# EAGLE design switching_vca (EAGLE 6.4)
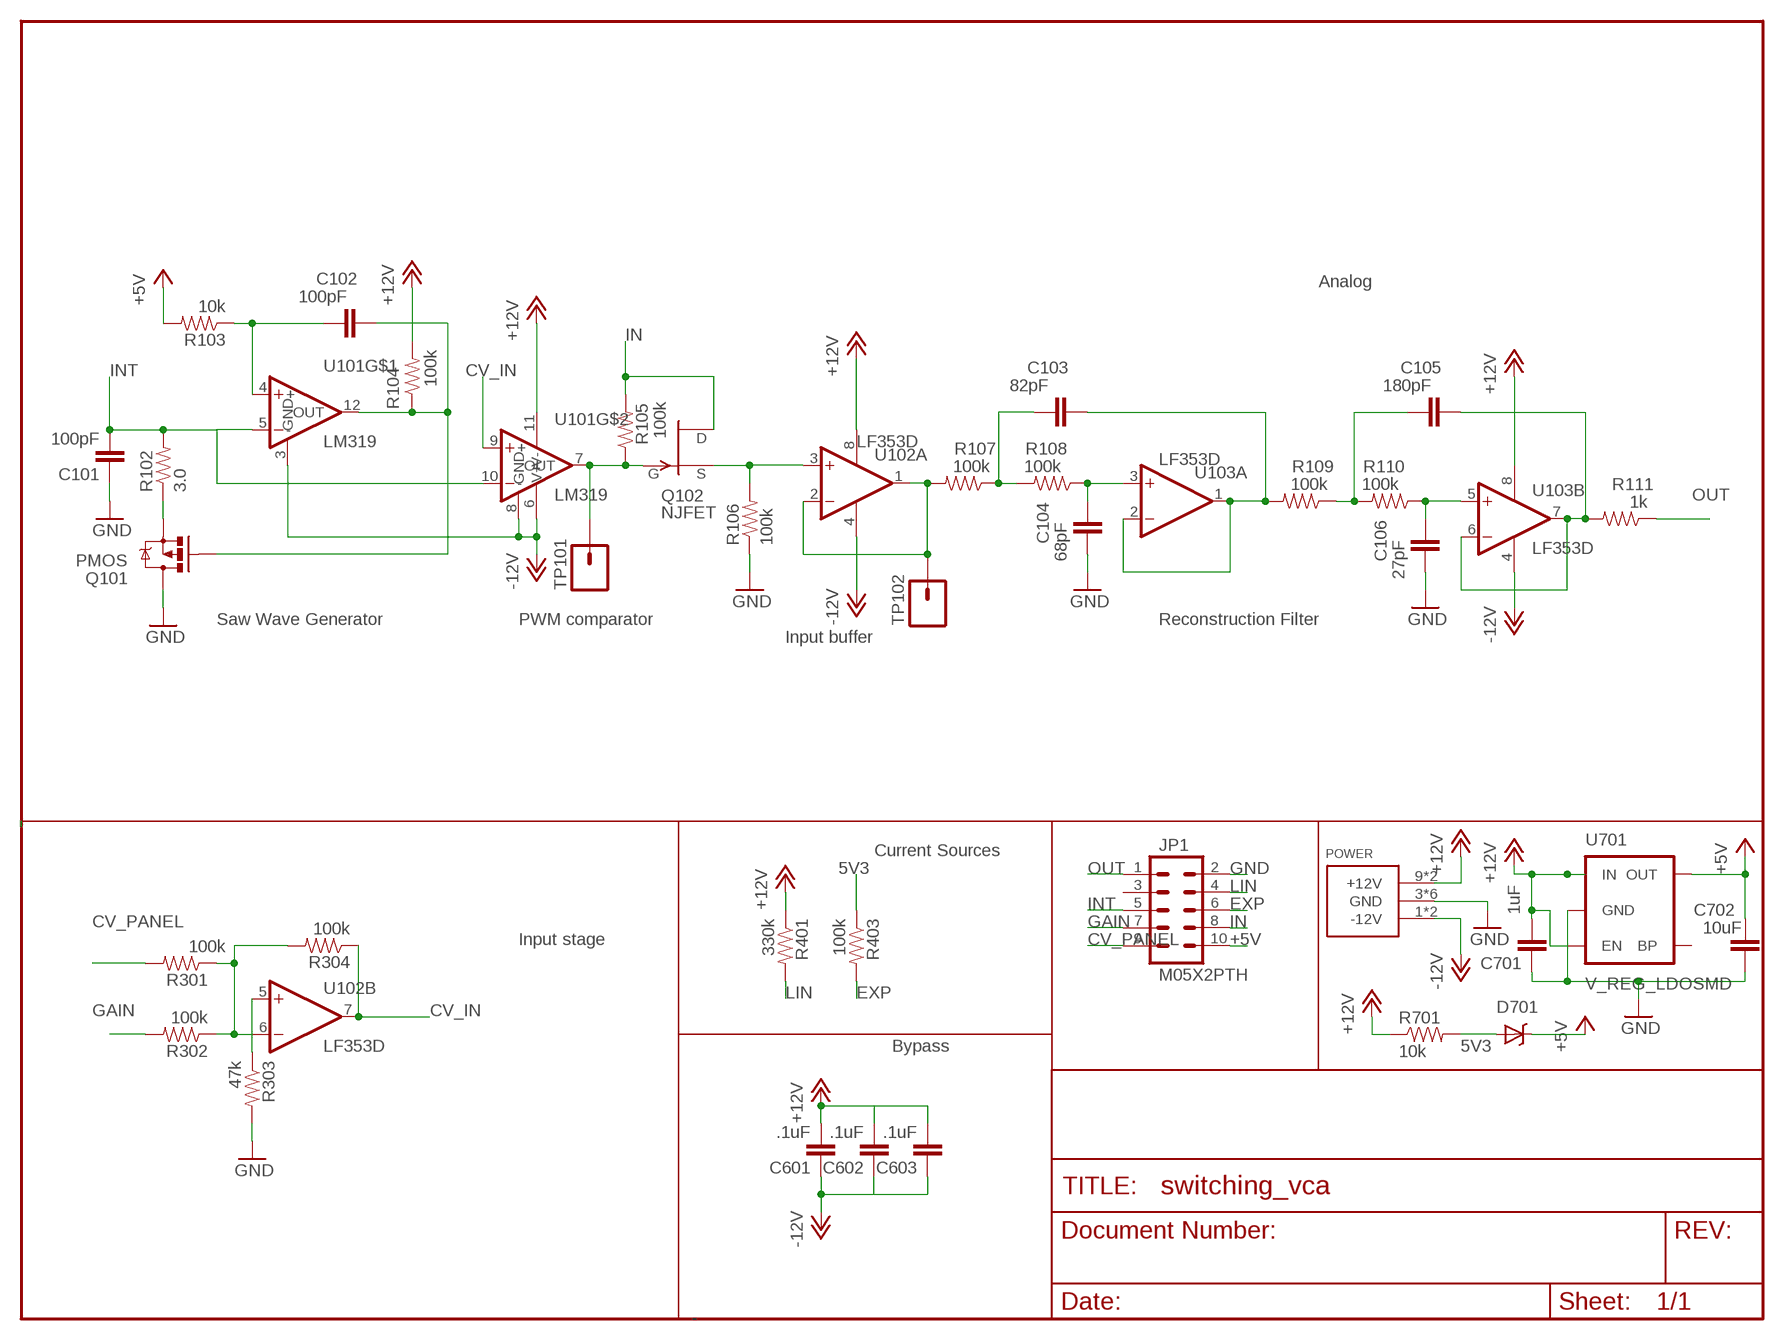
[diagram p0: schematic, sheet 1]

## Parts
C101  100pF  CAP0603-CAP  [0603-CAP]
C102  100pF  CAP0603-CAP  [0603-CAP]
C103  82pF  CAP0603-CAP  [0603-CAP]
C104  68pF  CAP0603-CAP  [0603-CAP]
C105  180pF  CAP0603-CAP  [0603-CAP]
C106  27pF  CAP0603-CAP  [0603-CAP]
C601  .1uF  CAP0603-CAP  [0603-CAP]
C602  .1uF  CAP0603-CAP  [0603-CAP]
C603  .1uF  CAP0603-CAP  [0603-CAP]
C701  1uF  CAP0805  [0805]
C702  10uF  CAP1206  [1206]
D701  DIODE-SCHOTTKY  [SOD-323]
JP1  M05X2PTH  [AVR_ICSP]
POWER  POWER_SIMPLE16  [POWER_16]
Q101  PMOS  MOSFET-PCHANNELSMD  [SOT23-3]
Q102  NJFET  SST5484  [SOT23]
R102  3.0  RESISTOR0603-RES  [0603-RES]
R103  10k  RESISTOR0603-RES  [0603-RES]
R104  100k  RESISTOR0603-RES  [0603-RES]
R105  100k  RESISTOR0603-RES  [0603-RES]
R106  100k  RESISTOR0603-RES  [0603-RES]
R107  100k  RESISTOR0603-RES  [0603-RES]
R108  100k  RESISTOR0603-RES  [0603-RES]
R109  100k  RESISTOR0603-RES  [0603-RES]
R110  100k  RESISTOR0603-RES  [0603-RES]
R111  1k  RESISTOR0603-RES  [0603-RES]
R301  100k  RESISTOR0603-RES  [0603-RES]
R302  100k  RESISTOR0603-RES  [0603-RES]
R303  47k  RESISTOR0603-RES  [0603-RES]
R304  100k  RESISTOR0603-RES  [0603-RES]
R401  330k  RESISTOR0603-RES  [0603-RES]
R403  100k  RESISTOR0603-RES  [0603-RES]
R701  10k  RESISTOR0603-RES  [0603-RES]
TP101  M01PTH  [1X01]
TP102  M01PTH  [1X01]
U101  LM319  [SOP-14]
U102  LF353D  [SO08]
U103  LF353D  [SO08]
U701  V_REG_LDOSMD  [SOT23-5]

## Nets
5V3: D701.1(A) R403.1 R701.2
+5V: C702.1 D701.2(C) JP1.10 R103.2 U701.5(OUT)
+12V: C601.2 C602.2 C603.2 C701.2 POWER.9(+12V) POWER.10(+12V) R104.2 R401.1 R701.1 U101.11(V+) U102.8(P:V+) U103.8(P:V+) U701.1(IN) U701.3(EN)
-12V: C601.1 C602.1 C603.1 POWER.1(-12V) POWER.2(-12V) U101.3(GND) U101.6(V-) U101.8(GND) U102.4(P:V-) U103.4(P:V-)
CV_IN: R304.1 U102.7(B:OUT)
CV_PANEL: JP1.9 R301.2
EXP: JP1.6 R403.2
GAIN: JP1.7 R302.2
GND: C101.1 C104.2 C106.2 C701.1 C702.2 JP1.2 POWER.3(GND) POWER.4(GND) POWER.5(GND) POWER.6(GND) POWER.7(GND) POWER.8(GND) Q101.3(D) R106.1 R303.2 U701.2(GND)
IN: JP1.8 Q102.1(D) R105.2
INT: C101.2 JP1.5 R102.2 U101.5(-) U101.10(-)
LIN: JP1.4 R401.2
N$: C102.1 Q101.1(G) R104.1 U101.12(OUT)
N$1: Q101.2(S) R102.1
N$3: Q102.3(G) R105.1 TP101.1 U101.7(OUT)
N$4: C102.2 R103.1 U101.4(+)
N$5: C103.1 R109.2 U103.1(A:OUT) U103.2(A:-IN)
N$6: Q102.2(S) R106.2 U102.3(A:+IN)
N$7: C103.2 R107.1 R108.2
N$8: C104.1 R108.1 U103.3(A:+IN)
N$10: R303.1 U102.5(B:+IN)
N$11: C105.2 R109.1 R110.2
N$12: C106.1 R110.1 U103.5(B:+IN)
N$13: C105.1 R111.2 U103.6(B:-IN) U103.7(B:OUT)
N$15: R107.2 TP102.1 U102.1(A:OUT) U102.2(A:-IN)
OUT: JP1.1 R111.1
R301: R301.1 R302.1 R304.2 U102.6(B:-IN)
Unconnected: JP1.3 U101.9(+) U701.4(BP)

## Notes on the sheet
- Analog
- Saw Wave Generator | PWM comparator | Reconstruction Filter
- Input buffer
- Current Sources
- Input stage
- Bypass

## Library data of the parts
C101-C106 C601-C603 C701 C702 = SparkFun:CAP: Capacitor Standard 0603 ceramic capacitor, and 0.1" leaded capacitor.
D701 = SparkFun:DIODE-SCHOTTKY
JP1 = SparkFun:M05X2: Header 5x2 Standard 10-pin dual row 0.1" header. Commonly used with AVR-ISP. Use with Spark Fun Electronics SKU: PRT-00778
POWER = eurorack:POWER_SIMPLE
Q101 = SparkFun:MOSFET-PCHANNEL
Q102 = transistor-fet:?548*: N-Channel JFETs Source: VISHAY 2N5484.pdf Compatible: TO92 2N5245 J304 J305 U310 J308 J309 J310 TO72 2N4416 2N4416A 2N3823 2N4351 3N169 3N170 3N171 MFE3002 TO18 2N3796 2N3797 MFE825 Source: Motorola European Master Guide Pacge 3-59
R102-R111 R301-R304 R401 R403 R701 = SparkFun:RESISTOR: Resistor Basic schematic elements and footprints for 0603, 1206, and PTH resistors.
TP101 TP102 = SparkFun:M01: Header 1 Standard 1-pin 0.1" header. Use with straight break away headers (SKU : PRT-00116), right angle break away headers (PRT-00553), swiss pins (PRT-00743), machine pins (PRT-00117), and female headers (PRT-00115).
U101 = russruss:LM319
U102 U103 = linear:LF353: OP AMP
U701 = SparkFun:V_REG_LDO: Voltage Regulator LDO Standard 150mA LDO voltage regulator in SOT-23 layout. Micrel part MIC5205. BP (by-pass) pin is used to lower output noise with 470pF cap.

## Board
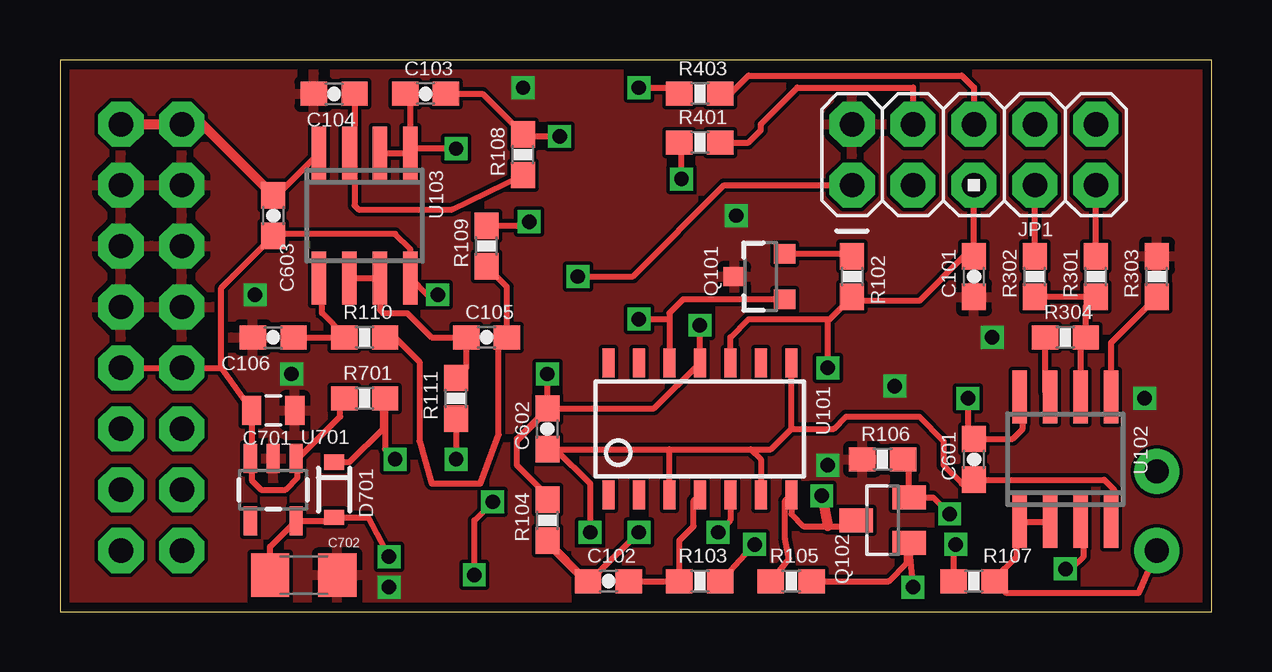
[diagram p1: board, top side]
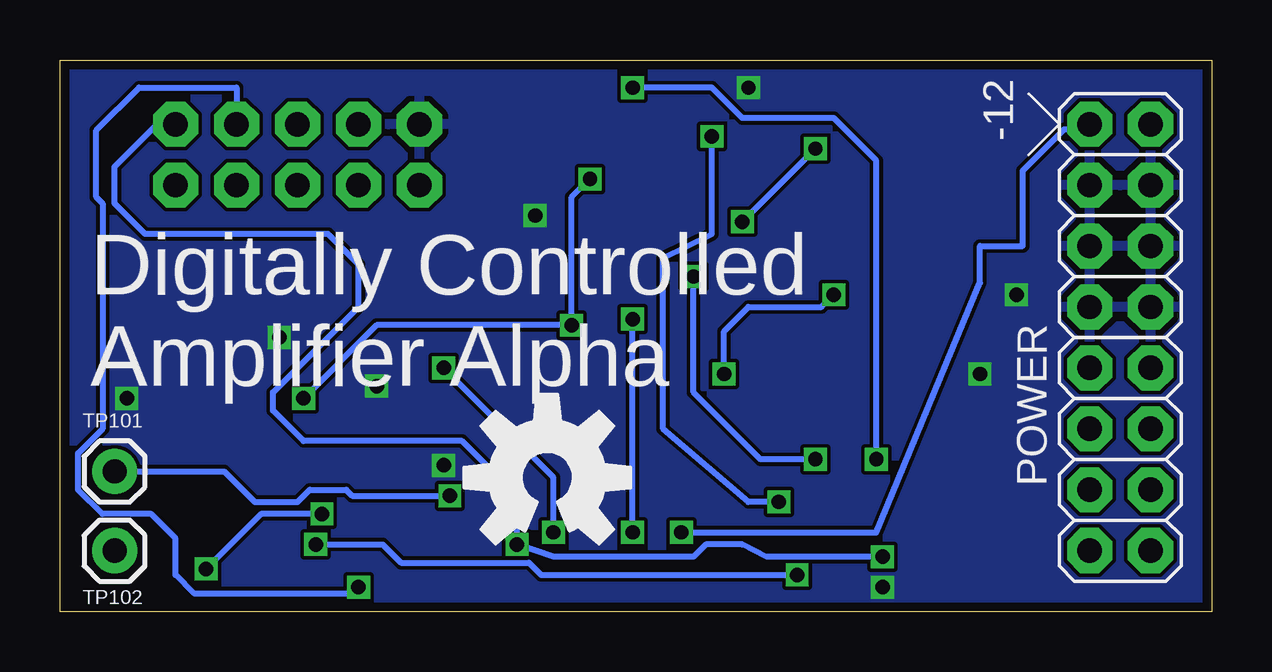
[diagram p2: board, bottom side, seen from below]

Size 48 x 23 mm. Coordinates in mm from the lower left corner, seen from the top.
Outline: 0,0 48,0 48,23 0,23 0,0
Copper layers (1*16): Top 0.0356mm / dielectric 1.5011mm / Bottom 0.0356mm
Design rules "LaenPCBOrder": minimum track width 6mil, minimum drill 13mil, track to track 6mil, track to pad 6mil, pad to pad 6mil, via to via 6mil, smd to smd 6mil, copper to edge 15mil, drill to drill 6mil, minimum pad ring 7mil, minimum via ring 7mil, stop-mask expansion 4mil, vias tented up to drill 0mil, thermal gap 10mil

### Footprints (pad centres in the part's own frame; a part is rotated, then mirrored left to right if it is on the bottom)
0603-CAP = smd 1.1 x 1: 1 -0.85,0; 2 0.85,0
0805 = smd 0.8 x 1.2: 1 -0.9,0; 2 0.9,0
1206 = smd 1.6 x 1.8: 1 -1.4,0; 2 1.4,0
SOD-323 = smd 0.63 x 0.83: 1 -1.15,0; 2 1.15,0
AVR_ICSP = drill 1.016 pad 1.88 octagon: 1 -1.27,5.08; 2 1.27,5.08; 3 -1.27,2.54; 4 1.27,2.54; 5 -1.27,0; 6 1.27,0; 7 -1.27,-2.54; 8 1.27,-2.54; 9 -1.27,-5.08; 10 1.27,-5.08
POWER_16 = drill 1.016 pad 1.88 octagon: 1 -6.35,-1.27; 2 -6.35,1.27; 3 -3.81,-1.27; 4 -3.81,1.27; 5 -1.27,-1.27; 6 -1.27,1.27; 7 1.27,-1.27; 8 1.27,1.27; 9 3.81,-1.27; 10 3.81,1.27; 11 6.35,-1.27; 12 6.35,1.27; 13 8.89,-1.27; 14 8.89,1.27; 15 11.43,-1.27; 16 11.43,1.27
SOT23-3 = smd 0.8 x 0.9: 1 -0.95,-1; 2 0.95,-1; 3 0,1.1
SOT23 = smd 1 x 1.4: 1 -0.95,-1.1; 2 0.95,-1.1; 3 0,1.1
0603-RES = smd 1.1 x 1: 1 -0.85,0; 2 0.85,0
1X01 = drill 1.016 pad 1.88: 1 0,0
SOP-14 = smd 0.5 x 1.2: 1 -3.81,-2.75; 2 -2.54,-2.75; 3 -1.27,-2.75; 4 0,-2.75; 5 1.27,-2.75; 6 2.54,-2.75; 7 3.81,-2.75; 8 3.81,2.75; 9 2.54,2.75; 10 1.27,2.75; 11 0,2.75; 12 -1.27,2.75; 13 -2.54,2.75; 14 -3.81,2.75
SO08 = smd 0.6 x 2.2: 1 -1.905,-2.6; 2 -0.635,-2.6; 3 0.635,-2.6; 4 1.905,-2.6; 5 1.905,2.6; 6 0.635,2.6; 7 -0.635,2.6; 8 -1.905,2.6
SOT23-5 = smd 0.55 x 1.2: 1 -0.95,-1.3; 2 0,-1.3; 3 0.95,-1.3; 4 0.95,1.3; 5 -0.95,1.3

### Placement (x,y rotation side)
C101  38.1,13.97 90 top
C102  22.86,1.27 0 top
C103  15.24,21.59 0 top
C104  11.43,21.59 180 top
C105  17.78,11.43 0 top
C106  8.89,11.43 180 top
C601  38.1,6.35 90 top
C602  20.32,7.62 90 top
C603  8.89,16.51 270 top
C701  8.89,8.38 180 top
C702  10.16,1.52 0 top
D701  11.43,5.08 270 top
JP1  38.1,19.05 90 top
POWER  3.81,13.97 270 bottom
Q101  29.21,13.97 90 top
Q102  34.29,3.81 90 top
R102  33.02,13.97 270 top
R103  26.67,1.27 0 top
R104  20.32,3.81 90 top
R105  30.48,1.27 0 top
R106  34.29,6.35 0 top
R107  38.1,1.27 0 top
R108  19.3,19.05 90 top
R109  17.78,15.24 90 top
R110  12.7,11.43 0 top
R111  16.51,8.89 90 top
R301  43.18,13.97 90 top
R302  40.64,13.97 90 top
R303  45.72,13.97 90 top
R304  41.91,11.43 0 top
R401  26.67,19.56 0 top
R403  26.67,21.59 0 top
R701  12.7,8.89 0 top
TP101  45.72,5.84 0 bottom
TP102  45.72,2.54 0 bottom
U101  26.67,7.62 0 top
U102  41.91,6.35 0 top
U103  12.7,16.51 180 top
U701  8.89,5.08 180 top
U$1  [OSHW-LOGO-L]  27.69,5.59 0 bottom

### Tracks (layer width: path | path; a pad name or v marks a point on that pad's centre or on a via)
5V3  (via drill 0.6)
  Top 0.254: D701.1 12.07,6.23 13.46,7.62 13.46,8.8 R701.2 13.55,6.77 v13.97,6.35 | v24.13,21.84 25.57,21.84 R403.1
  Bottom 0.254: v13.97,6.35 13.97,18.8 15.75,20.57 19.56,20.57 20.83,21.84 v24.13,21.84
+5V  (via drill 0.6)
  Top 0.254: C702.1 8.76,2.7 U701.5 11.28,3.78 D701.2 12.83,3.93 v13.72,2.29 | v28.96,2.79 27.94,1.69 R103.2
  Bottom 0.254: v13.72,2.29 18.54,2.29 19.56,2.79 21.08,2.79 21.59,2.29 27.43,2.29 v28.96,2.79 28.96,4.83 31.24,7.11 37.85,7.11 39.12,8.38 39.12,9.14 35.56,12.7 35.56,14.48 36.83,15.75 44.45,15.75 45.72,17.02 45.72,18.54 43.94,20.32 JP1.10
+12V  (via drill 0.6)
  Top 0.254: POWER.10 POWER.9 6.72,10.16 | 6.72,10.16 C701.2 7.99,6.43 7.99,5.47 8.38,5.08 9.4,5.08 9.91,5.59 9.91,6.31 U701.1 9.94,6.38 11.68,8.13 11.68,8.72 R701.1 | 6.72,10.16 6.72,13.49 C603.2 8.98,15.75 13.97,15.75 14.61,15.11 U103.8 15.31,13.21 v15.75,13.21 | R104.2 20.32,4.83 19.05,6.1 19.05,7.11 | U102.8 40.13,8.82 40.13,7.62 39.71,7.2 C601.2 37.85,7.45 v37.85,8.89 | v26.67,11.94 U101.11 24.77,8.47 C602.2 19.05,7.2 19.05,7.11 | v25.91,18.03 25.91,19.47 R401.1 | 19.05,7.11 20.32,8.38 v20.32,9.91
  Top 0.406: 7.99,6.43 U701.3
  Bottom 0.254: v37.85,8.89 34.8,11.94 v26.67,11.94 26.67,17.27 v25.91,18.03 | v20.32,9.91 20.32,11.68 19.3,12.7 16.26,12.7 v15.75,13.21
-12V  (via drill 0.6)
  Top 0.254: C603.1 9.04,17.36 U103.4 | U102.4 43.94,3.88 43.94,5.08 43.52,5.5 C601.1 37.93,5.33 37.59,5.33 36.83,6.1 36.83,7.11 35.81,8.13 32.77,8.13 32.26,7.62 30.48,7.62 | 25.4,6.77 C602.1 20.66,6.77 22.1,5.33 v22.1,3.3 | U101.3 25.4,6.77 | 25.4,6.77 28.79,6.77 | 28.79,6.77 29.21,6.35 U101.6 | 28.79,6.77 29.63,6.77 30.48,7.62 | 30.48,7.62 U101.8
  Top 0.406: POWER.2 POWER.1 5.93,20.32 C603.1
  Bottom 0.254: v22.1,3.3 13.97,3.3 9.65,13.72 9.65,15.24 7.87,15.24 7.87,18.38 6.14,20.11 5.29,20.11 POWER.1
CV_IN
  Top 0.254: R304.1 41.06,9.16 U102.7
CV_PANEL
  Top 0.254: R301.2 JP1.9
EXP
  Top 0.254: R403.2 27.94,21.59 28.7,22.35 37.59,22.35 38.1,21.84 JP1.6
GAIN
  Top 0.254: R302.2 JP1.7
GND  (via drill 0.6)
  other vias: 8.13,13.21 32,6.1 45.21,8.89 13.72,1.02 19.3,21.84 28.19,16.51 9.65,9.91 38.86,11.43 34.8,9.4
  pour Bottom: 0,23 48,23 48,0 0,0
  pour Top: 0,23 0,0 48,0 48,23
IN  (via drill 0.6)
  Top 0.254: R105.2 34.54,1.27 35.31,2.03 35.31,2.78 Q102.1 35.39,2.71 v35.56,1.02
  Bottom 0.254: JP1.8 40.64,21.84 44.7,21.84 46.48,20.07 46.48,17.27 46.23,17.02 46.23,7.62 47.24,6.6 47.24,5.08 46.23,4.06 44.2,4.06 43.18,3.05 43.18,1.52 42.42,0.76 35.81,0.76 v35.56,1.02
INT  (via drill 0.6)
  Top 0.254: JP1.5 C101.2 37.68,14.82 35.81,12.95 33.19,12.95 R102.2 32.09,12.19 32,12.19 | U101.10 27.94,11.43 28.7,12.19 32,12.19 | U101.5 27.94,3.81 v27.43,3.3 | v32,10.16 32,12.19
  Bottom 0.254: v27.43,3.3 27.43,5.59 v32,10.16
LIN
  Top 0.254: JP1.4 35.56,21.84 30.73,21.84 29.21,20.32 29.21,20.07 28.7,19.56 R401.2
N$  (via drill 0.6)
  Top 0.254: C102.1 R104.1 20.32,2.79 21.59,1.52 22.35,1.52 v24.13,3.3 | Q101.1 25.97,13.02 25.4,12.45 25.4,12.19 | 25.4,12.19 U101.12 | v24.13,12.19 25.4,12.19
  Bottom 0.254: v24.13,3.3 v24.13,12.19
N$1
  Top 0.254: Q101.2 32.92,14.92 R102.1
N$3  (via drill 0.6)
  Top 0.254: R105.1 30.39,2.2 30.23,3.05 30.23,4.62 U101.7 30.48,4.06 30.99,3.56 32,3.56 32.94,3.56 Q102.3
  Top 0.406: v31.75,4.83 32,3.56
  Bottom 0.254: v31.75,4.83 35.81,4.83 36.07,5.08 37.59,5.08 38.1,4.57 39.88,4.57 41.15,5.84 TP101.1
N$4
  Top 0.254: C102.2 R103.1 25.82,2.96 26.42,3.56 26.42,4.62 U101.4
N$5  (via drill 0.6)
  Top 0.254: U103.2 U103.1 | U103.1 14.61,21.38 C103.1 | R109.2 19.39,16.09 v19.56,16.26 | v16.51,19.3 14.8,19.3 U103.1
  Bottom 0.254: v19.56,16.26 v16.51,19.3
N$6  (via drill 0.6)
  Top 0.254: R106.2 35.39,6.1 Q102.2 36.39,4.76 v37.08,4.06 | v41.91,1.78 42.16,1.78 42.67,2.29 42.67,3.62 U102.3
  Bottom 0.254: v37.08,4.06 39.62,4.06 v41.91,1.78
N$7  (via drill 0.6)
  Top 0.254: C103.2 17.61,21.59 R108.2 19.39,19.81 v20.83,19.81 | R107.1 37.25,2.71 v37.34,2.79 | v17.27,1.52 17.27,3.81 v18.03,4.57
  Bottom 0.254: v37.34,2.79 34.54,2.79 33.78,2.03 28.45,2.03 27.94,1.52 v17.27,1.52 | v18.03,4.57 19.3,4.57 22.86,7.62 22.86,14.73 20.83,15.75 v20.83,19.81
N$8
  Top 0.254: C104.1 12.28,19.32 | 12.28,19.32 U103.3 | 12.28,19.32 12.28,16.93 12.45,16.76 16.34,16.76 R108.1
N$10
  Top 0.254: U102.5 43.81,11.21 R303.1
N$11
  Top 0.254: R110.2 13.97,11.43 14.99,10.41 14.99,7.11 15.49,5.33 17.53,5.33 18.29,7.37 18.29,11.09 C105.2 18.63,13.54 R109.1
N$12
  Top 0.254: C106.1 R110.1 11.85,11.52 10.92,12.45 10.92,13.78 U103.5
N$13
  Top 0.254: U103.6 U103.7 13.34,12.57 13.46,12.45 14.48,12.45 15.49,11.43 C105.1 16.93,10.16 R111.2
N$15
  Top 0.254: U102.2 U102.1 39.88,3.62 39.88,2.29 38.95,1.36 R107.2 39.46,0.76 44.96,0.76 TP102.1
OUT  (via drill 0.6)
  Top 0.254: R111.1 v16.51,6.35 | v21.59,13.97 23.88,13.97 27.69,17.78 JP1.1
  Bottom 0.254: v16.51,6.35 18.8,6.35 21.59,9.14 v21.59,13.97
R301
  Top 0.254: U102.6 42.55,11.21 R304.2 42.76,12.7 R301.1 R302.1

### Text on the board
bNames: Digitally Controlled / Amplifier Alpha